# Altium project Arm.PrjPcb
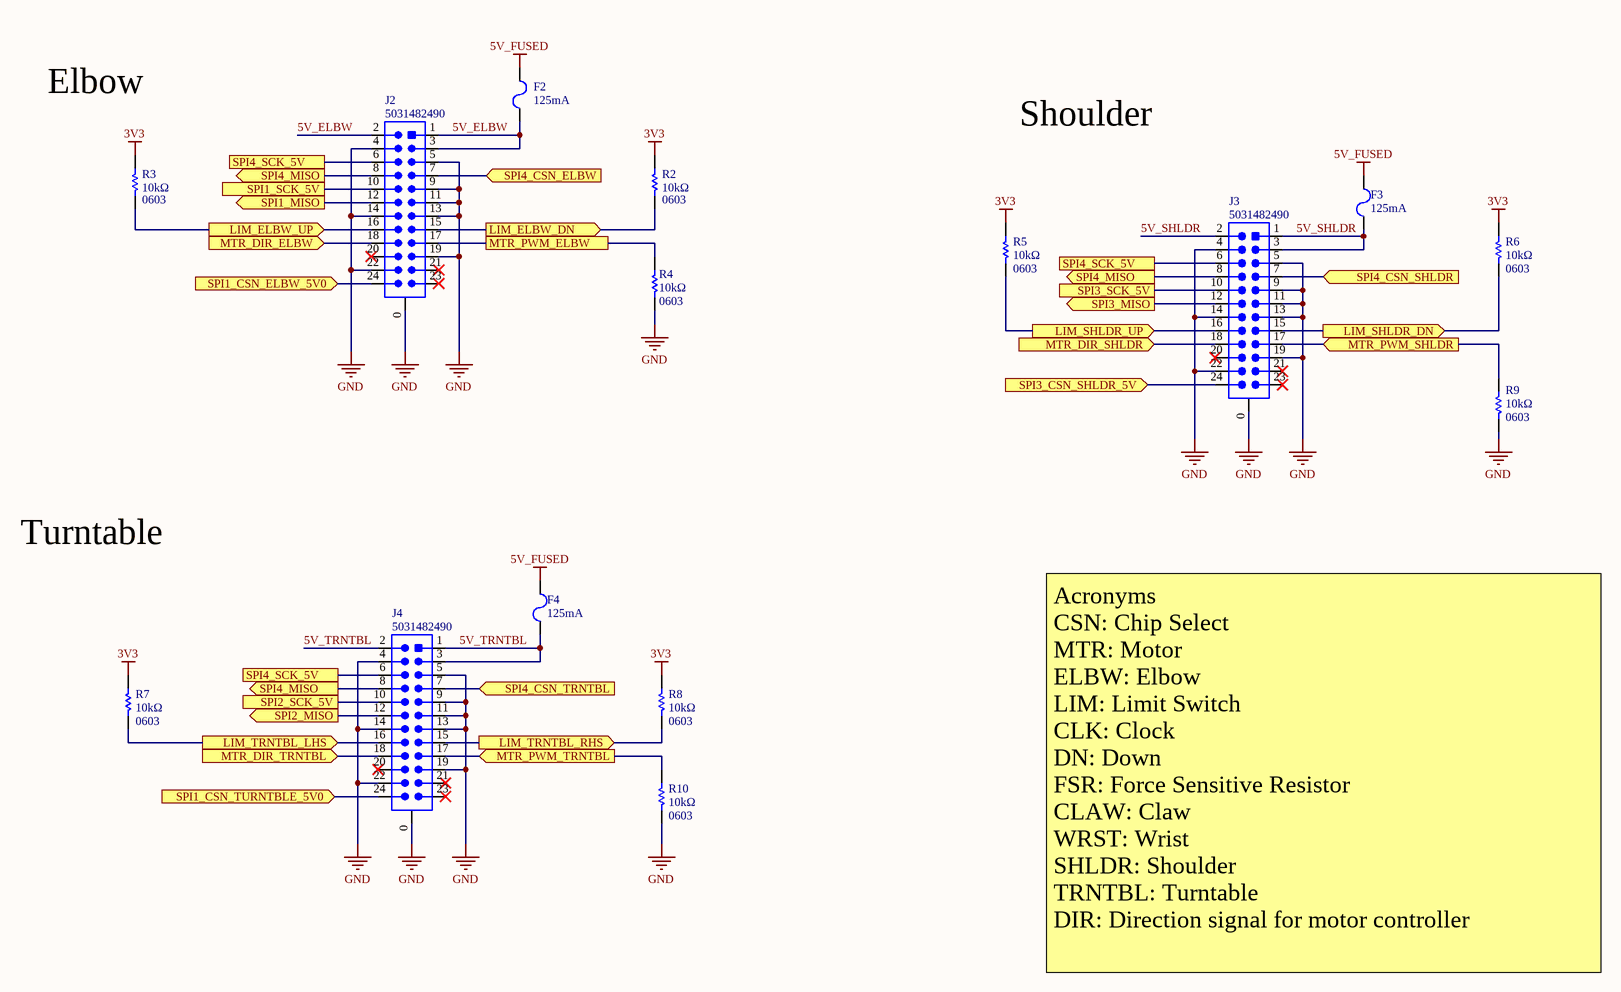
[diagram p0: SH2 - CONNECTORS_1.SchDoc]
CheckedBy: Lance Bantoto; Engineer: Kyle Hong; Revision: 2
5 sheets, 93 parts. Net scope: flat (ports and power ports of the same name join across sheets).
Board file: Arm.PcbDoc
Sheets:
  SH2 - CONNECTORS_1.SchDoc
  SH3 - CONNECTORS_2.SchDoc
  SH4 - LEVEL SHIFTERS.SchDoc
  SH5 - MICROCONTROLLER.SchDoc
  SH6 - CAN.SchDoc

## Sheet SH2 - CONNECTORS_1.SchDoc: Connectors 1
size B; CheckedBy: Lance Bantoto; DrawnBy: Kyle Hong; Engineer: Kyle Hong; Revision: 2; SheetNumber: 2; SheetTotal: 8

### Parts
F2  Current Rating: 125mA  [FUSE_1206]  (hidden comment: FUSE_125mA_1206)
F3  Current Rating: 125mA  [FUSE_1206]  (hidden comment: FUSE_125mA_1206)
F4  Current Rating: 125mA  [FUSE_1206]  (hidden comment: FUSE_125mA_1206)
J2  Manufacturer Part Number 1: 5031482490  [MOLEX-5031482490]  (hidden comment: CON_12x2M_SM_RA)
J3  Manufacturer Part Number 1: 5031482490  [MOLEX-5031482490]  (hidden comment: CON_12x2M_SM_RA)
J4  Manufacturer Part Number 1: 5031482490  [MOLEX-5031482490]  (hidden comment: CON_12x2M_SM_RA)
R2  value 10kΩ  Package/Footprint: 0603  [RESC0603]  (hidden comment: RES_10kΩ_0603_5%)
R3  value 10kΩ  Package/Footprint: 0603  [RESC0603]  (hidden comment: RES_10kΩ_0603_5%)
R4  value 10kΩ  Package/Footprint: 0603  [RESC0603]  (hidden comment: RES_10kΩ_0603_5%)
R5  value 10kΩ  Package/Footprint: 0603  [RESC0603]  (hidden comment: RES_10kΩ_0603_5%)
R6  value 10kΩ  Package/Footprint: 0603  [RESC0603]  (hidden comment: RES_10kΩ_0603_5%)
R7  value 10kΩ  Package/Footprint: 0603  [RESC0603]  (hidden comment: RES_10kΩ_0603_5%)
R8  value 10kΩ  Package/Footprint: 0603  [RESC0603]  (hidden comment: RES_10kΩ_0603_5%)
R9  value 10kΩ  Package/Footprint: 0603  [RESC0603]  (hidden comment: RES_10kΩ_0603_5%)
R10  value 10kΩ  Package/Footprint: 0603  [RESC0603]  (hidden comment: RES_10kΩ_0603_5%)

### Ports
LIM_ELBW_DN (out), LIM_ELBW_UP (out), LIM_SHLDR_DN (out), LIM_SHLDR_UP (out), LIM_TRNTBL_LHS (out), LIM_TRNTBL_RHS (out), MTR_DIR_ELBW (in), MTR_DIR_SHLDR (in), MTR_DIR_TRNTBL (in), MTR_PWM_ELBW, MTR_PWM_SHLDR (in), MTR_PWM_TRNTBL (in), SPI1_CSN_ELBW_5V0 (in), SPI1_CSN_TURNTBLE_5V0 (in), SPI1_MISO (out), SPI1_SCK_5V, SPI2_MISO (out), SPI2_SCK_5V, SPI3_CSN_SHLDR_5V (in), SPI3_MISO (out), SPI3_SCK_5V, SPI4_CSN_ELBW (in), SPI4_CSN_SHLDR (in), SPI4_CSN_TRNTBL (in), SPI4_MISO (out), SPI4_SCK_5V

### Nets
3V3: R2.2 R3.2 R5.2 R6.2 R7.2 R8.2
5V_FUSED: F2.2 F3.2 F4.2
GND: J2.0 J2.4 J2.5 J2.9 J2.11 J2.13 J2.14 J2.19 J2.22 J3.0 J3.4 J3.5 J3.9 J3.11 J3.13 J3.14 J3.19 J3.22 J4.0 J4.4 J4.5 J4.9 J4.11 J4.13 J4.14 J4.19 J4.22 R4.1 R9.1 R10.1
5V_ELBW: F2.1 J2.1 J2.2 J2.3
5V_SHLDR: F3.1 J3.1 J3.2 J3.3
5V_TRNTBL: F4.1 J4.1 J4.2 J4.3
NetJ2_6: J2.6 J3.6 J4.6 ; port SPI4_SCK_5V
NetJ2_7: J2.7 ; port SPI4_CSN_ELBW
NetJ2_8: J2.8 J3.8 J4.8 ; port SPI4_MISO
NetJ2_10: J2.10 ; port SPI1_SCK_5V
NetJ2_12: J2.12 ; port SPI1_MISO
NetJ2_15: J2.15 R2.1 ; port LIM_ELBW_DN
NetJ2_16: J2.16 R3.1 ; port LIM_ELBW_UP
NetJ2_17: J2.17 R4.2 ; port MTR_PWM_ELBW
NetJ2_18: J2.18 ; port MTR_DIR_ELBW
NetJ2_24: J2.24 ; port SPI1_CSN_ELBW_5V0
NetJ3_7: J3.7 ; port SPI4_CSN_SHLDR
NetJ3_10: J3.10 ; port SPI3_SCK_5V
NetJ3_12: J3.12 ; port SPI3_MISO
NetJ3_15: J3.15 R6.1 ; port LIM_SHLDR_DN
NetJ3_16: J3.16 R5.1 ; port LIM_SHLDR_UP
NetJ3_17: J3.17 R9.2 ; port MTR_PWM_SHLDR
NetJ3_18: J3.18 ; port MTR_DIR_SHLDR
NetJ3_24: J3.24 ; port SPI3_CSN_SHLDR_5V
NetJ4_7: J4.7 ; port SPI4_CSN_TRNTBL
NetJ4_10: J4.10 ; port SPI2_SCK_5V
NetJ4_12: J4.12 ; port SPI2_MISO
NetJ4_15: J4.15 R8.1 ; port LIM_TRNTBL_RHS
NetJ4_16: J4.16 R7.1 ; port LIM_TRNTBL_LHS
NetJ4_17: J4.17 R10.2 ; port MTR_PWM_TRNTBL
NetJ4_18: J4.18 ; port MTR_DIR_TRNTBL
NetJ4_24: J4.24 ; port SPI1_CSN_TURNTBLE_5V0

Not connected (* = marked no-connect by the designer): J2 20* 21* 23*; J3 20* 21* 23*; J4 20* 21* 23*

### Notes on the sheet
- Elbow
- Shoulder
- Turntable
- Acronyms
  CSN: Chip Select
  MTR: Motor
  ELBW: Elbow
  LIM: Limit Switch
  CLK: Clock
  DN: Down
  FSR: Force Sensitive Resistor
  CLAW: Claw
  WRST: Wrist
  SHLDR: Shoulder
  TRNTBL: Turntable
  DIR: Direction signal for motor controller
- Title:
- Project:
- Date:
- Rev:
- Reviewer:
- Engineer:
- Sheet:
- of

### Library data of the parts
F2-F4 = FUSE_125mA_1206: FUSE BOARD MNT 125MA 125VAC/VDC; Manufacturer 1: Littelfuse; Manufacturer Part Number 1: 0466.125NR; Voltage Rating (DC): 125V; Package/Footprint: 1206; Supplier 1: Digi-Key; Supplier Part Number 1: F1450CT-ND; Mounting Type: SMD
J2-J4 = CON_12x2M_SM_RA: CONN HEADER SMD RIGHT ANGLE 1.5MM PITCH; Manufacturer 1: Molex; Voltage Rating: 100V; Current Rating: 2A; Supplier 1: Digi-Key; Orientation: Right Angle; Pitch: 1.5mm; Supplier Part Number 1: WM20820CT-ND; Family: CLIK-Mate; Mounting Type: SMD; Package/Footprint: SMD
R2-R10 = RES_10kΩ_0603_5%: RES 10K OHM 5% 1/10W 0603; Manufacturer 1: Yageo; Manufacturer Part Number 1: RC0603JR-0710KL; Supplier Part Number 1: 311-10KGRCT-ND; Supplier 1: Digi-Key; Mounting Type: SMD

## Sheet SH3 - CONNECTORS_2.SchDoc: Connectors 2
size B; CheckedBy: Lance Bantoto; DrawnBy: Kyle Hong; Engineer: Kyle Hong; Revision: 2; SheetNumber: 3; SheetTotal: 8
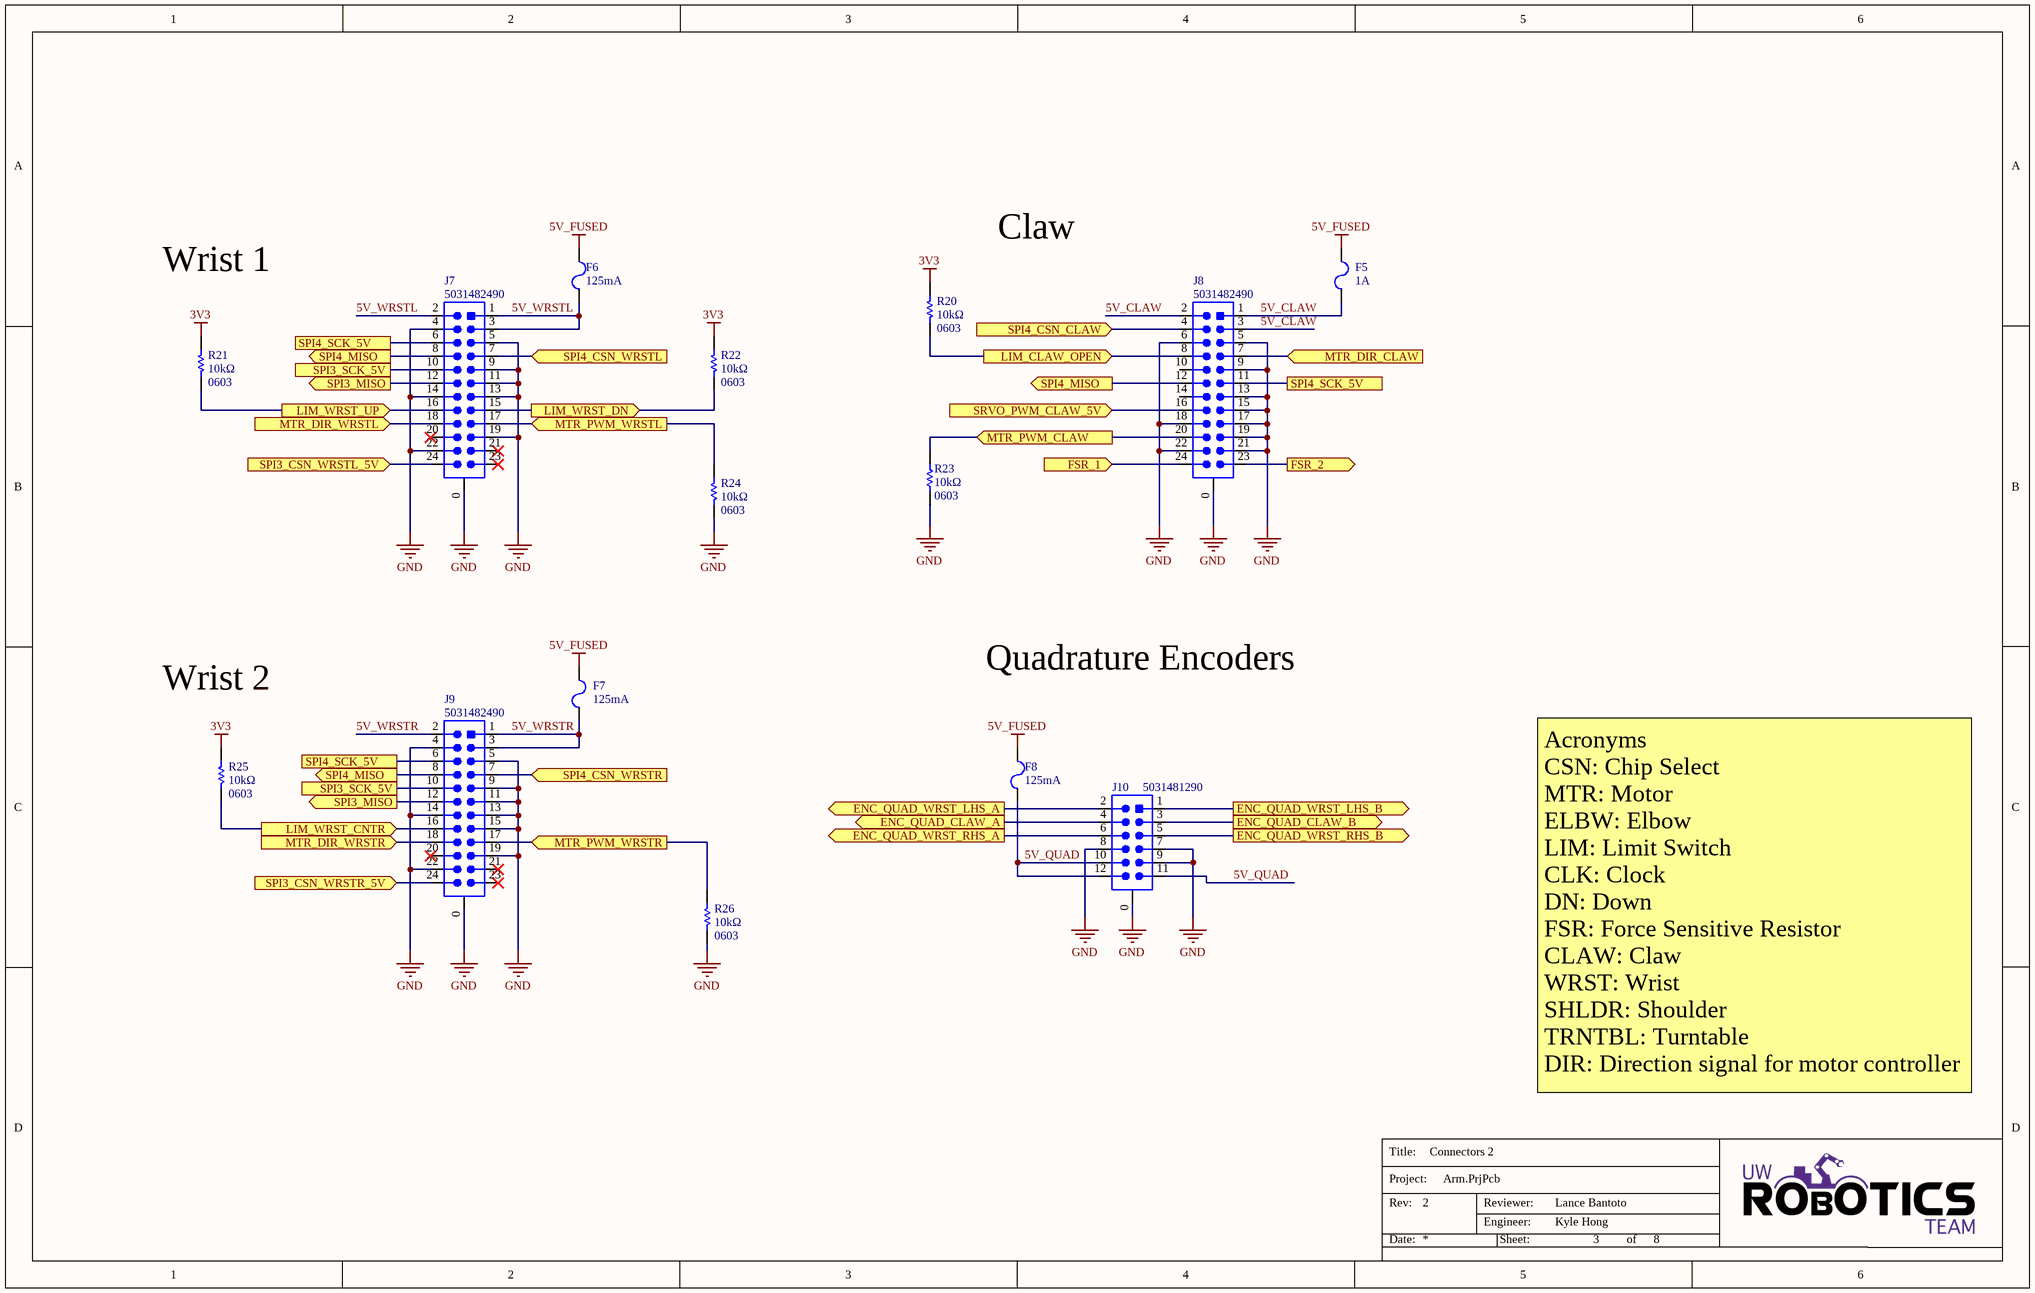
[diagram p1: SH3 - CONNECTORS_2.SchDoc]

### Parts
F5  Current Rating: 1A  [FUSE_1206]  (hidden comment: FUSE_1A_1206)
F6  Current Rating: 125mA  [FUSE_1206]  (hidden comment: FUSE_125mA_1206)
F7  Current Rating: 125mA  [FUSE_1206]  (hidden comment: FUSE_125mA_1206)
F8  Current Rating: 125mA  [FUSE_1206]  (hidden comment: FUSE_125mA_1206)
J7  Manufacturer Part Number 1: 5031482490  [MOLEX-5031482490]  (hidden comment: CON_12x2M_SM_RA)
J8  Manufacturer Part Number 1: 5031482490  [MOLEX-5031482490]  (hidden comment: CON_12x2M_SM_RA)
J9  Manufacturer Part Number 1: 5031482490  [MOLEX-5031482490]  (hidden comment: CON_12x2M_SM_RA)
J10  Manufacturer Part Number 1: 5031481290  [MOLEX-5031481290]  (hidden comment: CON_6x2M_SM_RA)
R20  value 10kΩ  Package/Footprint: 0603  [RESC0603]  (hidden comment: RES_10kΩ_0603_5%)
R21  value 10kΩ  Package/Footprint: 0603  [RESC0603]  (hidden comment: RES_10kΩ_0603_5%)
R22  value 10kΩ  Package/Footprint: 0603  [RESC0603]  (hidden comment: RES_10kΩ_0603_5%)
R23  value 10kΩ  Package/Footprint: 0603  [RESC0603]  (hidden comment: RES_10kΩ_0603_5%)
R24  value 10kΩ  Package/Footprint: 0603  [RESC0603]  (hidden comment: RES_10kΩ_0603_5%)
R25  value 10kΩ  Package/Footprint: 0603  [RESC0603]  (hidden comment: RES_10kΩ_0603_5%)
R26  value 10kΩ  Package/Footprint: 0603  [RESC0603]  (hidden comment: RES_10kΩ_0603_5%)

### Ports
ENC_QUAD_CLAW_A (out), ENC_QUAD_CLAW_B (out), ENC_QUAD_WRST_LHS_A (out), ENC_QUAD_WRST_LHS_B (out), ENC_QUAD_WRST_RHS_A (out), ENC_QUAD_WRST_RHS_B (out), FSR_1 (in), FSR_2 (out), LIM_CLAW_OPEN (out), LIM_WRST_CNTR (out), LIM_WRST_DN (out), LIM_WRST_UP (out), MTR_DIR_CLAW (in), MTR_DIR_WRSTL (in), MTR_DIR_WRSTR (in), MTR_PWM_CLAW (in), MTR_PWM_WRSTL (in), MTR_PWM_WRSTR (in), SPI3_CSN_WRSTL_5V (in), SPI3_CSN_WRSTR_5V (in), SPI3_MISO (out), SPI3_SCK_5V, SPI4_CSN_CLAW (in), SPI4_CSN_WRSTL (in), SPI4_CSN_WRSTR (in), SPI4_MISO (out), SPI4_SCK_5V, SRVO_PWM_CLAW_5V (in)

### Nets
3V3: R20.2 R21.2 R22.2 R25.2
5V_FUSED: F5.2 F6.2 F7.2 F8.2
GND: J7.0 J7.4 J7.5 J7.9 J7.11 J7.13 J7.14 J7.19 J7.22 J8.0 J8.5 J8.6 J8.9 J8.13 J8.15 J8.17 J8.18 J8.19 J8.21 J8.22 J9.0 J9.4 J9.5 J9.9 J9.11 J9.13 J9.14 J9.15 J9.19 J9.22 J10.0 J10.7 J10.8 J10.9 R23.1 R24.1 R26.1
5V_CLAW: F5.1 J8.1 J8.2 J8.3
5V_QUAD: F8.1 J10.10 J10.11 J10.12
5V_WRSTL: F6.1 J7.1 J7.2 J7.3
5V_WRSTR: F7.1 J9.1 J9.2 J9.3
NetJ2_6: J7.6 J8.11 J9.6 ; port SPI4_SCK_5V
NetJ2_8: J7.8 J8.12 J9.8 ; port SPI4_MISO
NetJ3_10: J7.10 J9.10 ; port SPI3_SCK_5V
NetJ3_12: J7.12 J9.12 ; port SPI3_MISO
NetJ7_7: J7.7 ; port SPI4_CSN_WRSTL
NetJ7_15: J7.15 R22.1 ; port LIM_WRST_DN
NetJ7_16: J7.16 R21.1 ; port LIM_WRST_UP
NetJ7_17: J7.17 R24.2 ; port MTR_PWM_WRSTL
NetJ7_18: J7.18 ; port MTR_DIR_WRSTL
NetJ7_24: J7.24 ; port SPI3_CSN_WRSTL_5V
NetJ8_4: J8.4 ; port SPI4_CSN_CLAW
NetJ8_7: J8.7 ; port MTR_DIR_CLAW
NetJ8_8: J8.8 R20.1 ; port LIM_CLAW_OPEN
NetJ8_16: J8.16 ; port SRVO_PWM_CLAW_5V
NetJ8_20: J8.20 R23.2 ; port MTR_PWM_CLAW
NetJ8_23: J8.23 ; port FSR_2
NetJ8_24: J8.24 ; port FSR_1
NetJ9_7: J9.7 ; port SPI4_CSN_WRSTR
NetJ9_16: J9.16 R25.1 ; port LIM_WRST_CNTR
NetJ9_17: J9.17 R26.2 ; port MTR_PWM_WRSTR
NetJ9_18: J9.18 ; port MTR_DIR_WRSTR
NetJ9_24: J9.24 ; port SPI3_CSN_WRSTR_5V
NetJ10_1: J10.1 ; port ENC_QUAD_WRST_LHS_B
NetJ10_2: J10.2 ; port ENC_QUAD_WRST_LHS_A
NetJ10_3: J10.3 ; port ENC_QUAD_CLAW_B
NetJ10_4: J10.4 ; port ENC_QUAD_CLAW_A
NetJ10_5: J10.5 ; port ENC_QUAD_WRST_RHS_B
NetJ10_6: J10.6 ; port ENC_QUAD_WRST_RHS_A

Not connected (* = marked no-connect by the designer): J7 20* 21* 23*; J8 10 14; J9 20* 21* 23*

### Notes on the sheet
- Wrist 1
- Claw
- Wrist 2
- Quadrature Encoders
- Acronyms
  CSN: Chip Select
  MTR: Motor
  ELBW: Elbow
  LIM: Limit Switch
  CLK: Clock
  DN: Down
  FSR: Force Sensitive Resistor
  CLAW: Claw
  WRST: Wrist
  SHLDR: Shoulder
  TRNTBL: Turntable
  DIR: Direction signal for motor controller
- Title:
- Project:
- Date:
- Rev:
- Reviewer:
- Engineer:
- Sheet:
- of

### Library data of the parts
F5 = FUSE_1A_1206: FUSE BOARD MOUNT 1A 125VAC 63VDC; Manufacturer 1: Bel Fuse Inc.; Manufacturer Part Number 1: C1Q 1; Package/Footprint: 1206; Supplier 1: Digi-Key; Supplier Part Number 1: 507-1077-1-ND; Mounting Type: SMD; LCSC Part #: *
F6-F8 = FUSE_125mA_1206: as F2 on sheet SH2 - CONNECTORS_1; Supplier 1: Digi-Key; Supplier Part Number 1: F1450CT-ND; Mounting Type: SMD
J7-J9 = CON_12x2M_SM_RA: as J2 on sheet SH2 - CONNECTORS_1; Supplier 1: Digi-Key; Orientation: Right Angle; Pitch: 1.5mm; Supplier Part Number 1: WM20820CT-ND; Family: CLIK-Mate; Mounting Type: SMD; Package/Footprint: SMD
J10 = CON_6x2M_SM_RA: CONN HEADER SMD RIGHT ANGLE 1.5MM PITCH; Manufacturer 1: Molex; Voltage Rating: 100V; Current Rating: 1A; Supplier 1: Digi-Key; Orientation: Right Angle; Pitch: 1.5mm; Supplier Part Number 1: WM14476CT-ND; Mounting Type: SMD; Package/Footprint: SMD
R20-R26 = RES_10kΩ_0603_5%: as R2 on sheet SH2 - CONNECTORS_1; Supplier Part Number 1: 311-10KGRCT-ND; Supplier 1: Digi-Key; Mounting Type: SMD

## Sheet SH4 - LEVEL SHIFTERS.SchDoc: Level Shifters
size B; CheckedBy: Lance Bantoto; DrawnBy: Kyle Hong; Engineer: Kyle Hong; Revision: 2; SheetNumber: 4; SheetTotal: 8
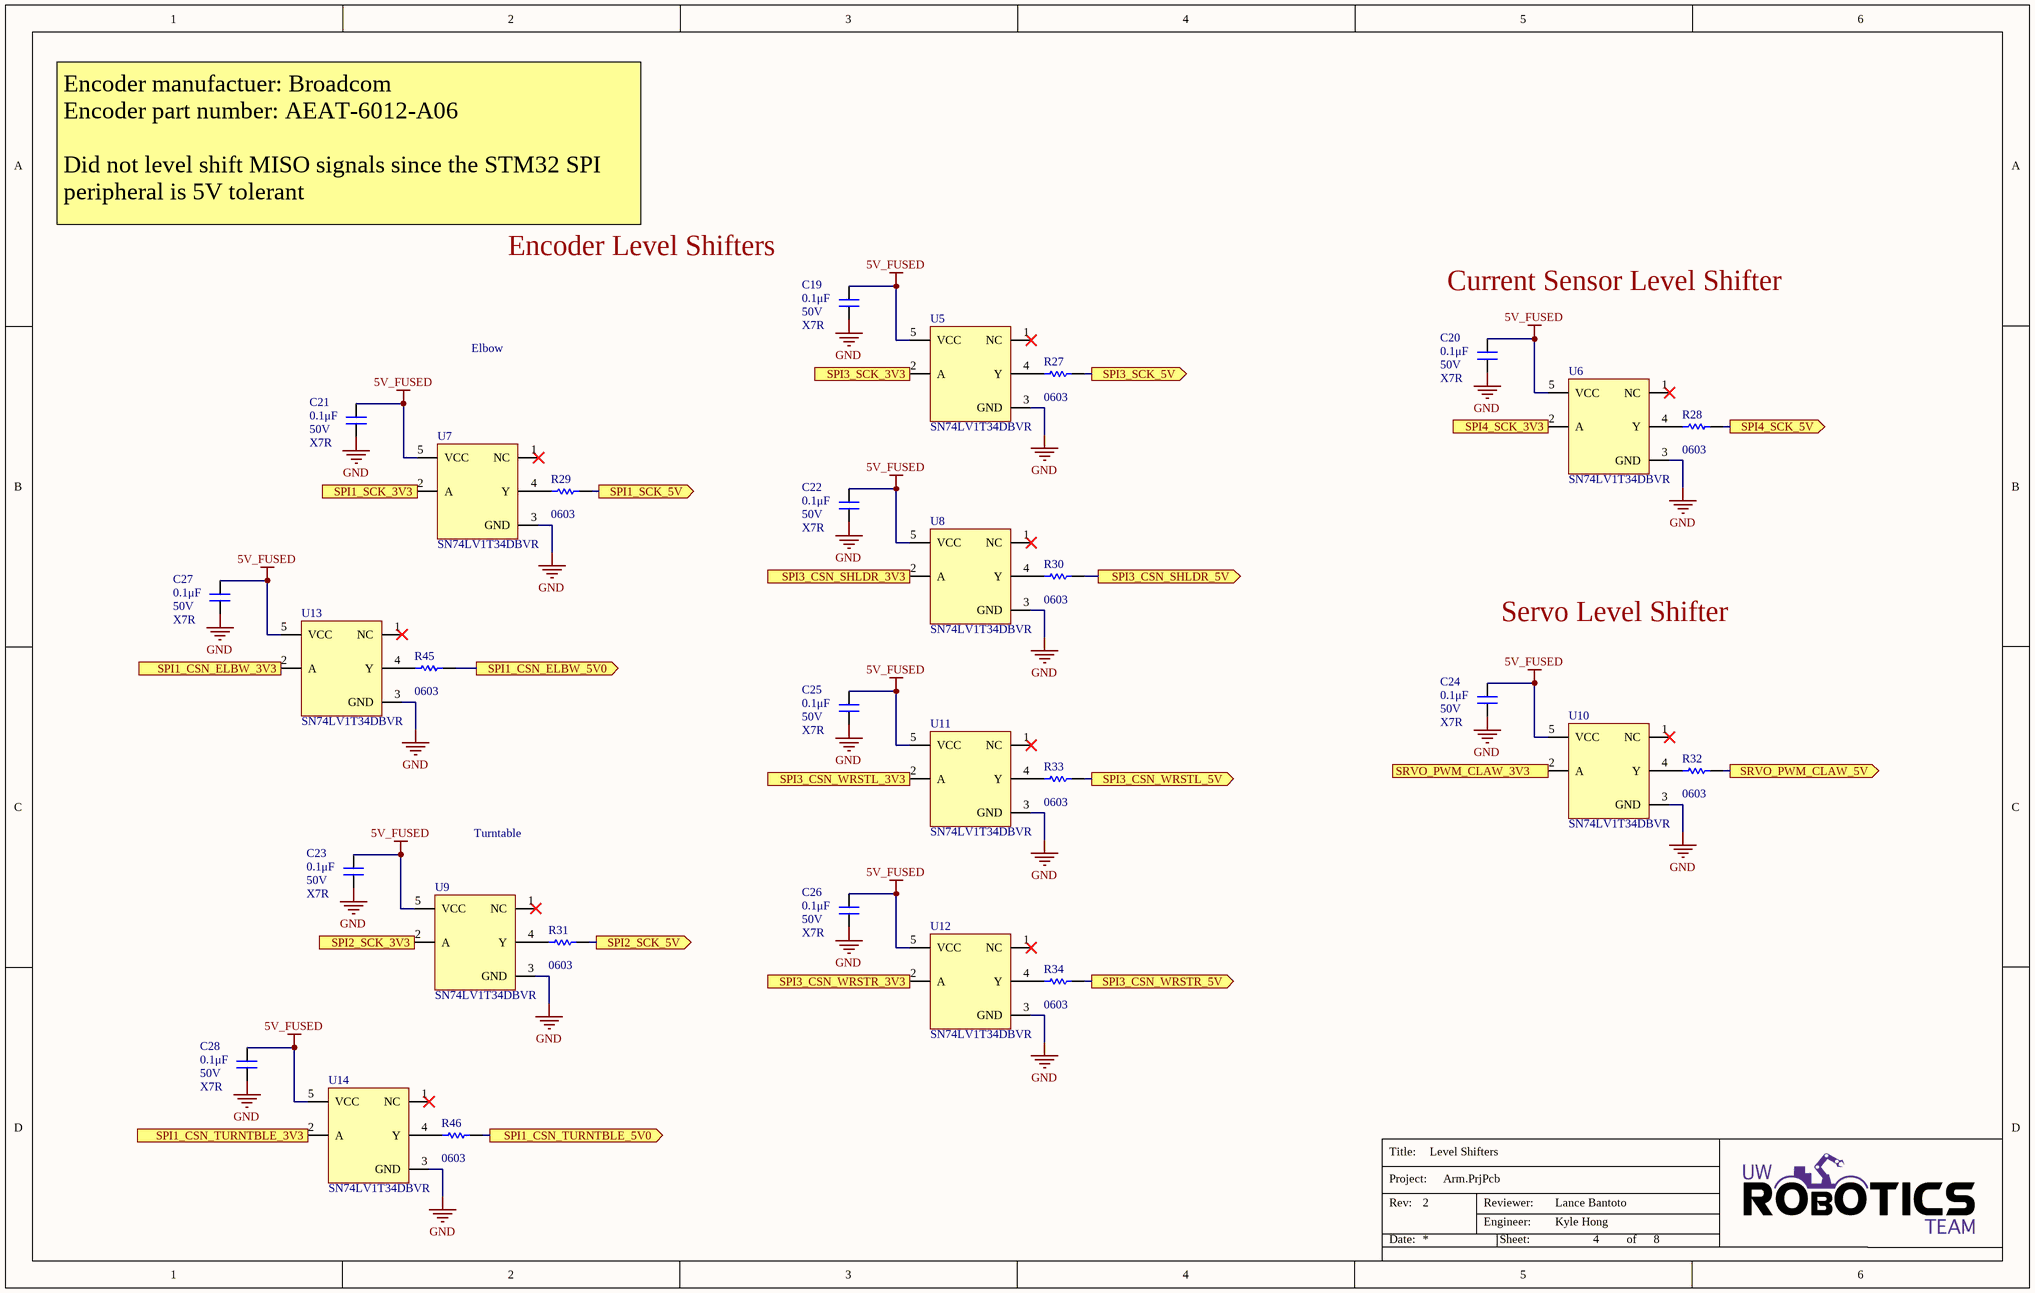
[diagram p2: SH4 - LEVEL SHIFTERS.SchDoc]

### Parts
C19  value 0.1μF  Dielectric: X7R  Voltage Rating: 50V  [CAP0603]  (hidden comment: CAP_0.1uF_50V_0603)
C20  value 0.1μF  Dielectric: X7R  Voltage Rating: 50V  [CAP0603]  (hidden comment: CAP_0.1uF_50V_0603)
C21  value 0.1μF  Dielectric: X7R  Voltage Rating: 50V  [CAP0603]  (hidden comment: CAP_0.1uF_50V_0603)
C22  value 0.1μF  Dielectric: X7R  Voltage Rating: 50V  [CAP0603]  (hidden comment: CAP_0.1uF_50V_0603)
C23  value 0.1μF  Dielectric: X7R  Voltage Rating: 50V  [CAP0603]  (hidden comment: CAP_0.1uF_50V_0603)
C24  value 0.1μF  Dielectric: X7R  Voltage Rating: 50V  [CAP0603]  (hidden comment: CAP_0.1uF_50V_0603)
C25  value 0.1μF  Dielectric: X7R  Voltage Rating: 50V  [CAP0603]  (hidden comment: CAP_0.1uF_50V_0603)
C26  value 0.1μF  Dielectric: X7R  Voltage Rating: 50V  [CAP0603]  (hidden comment: CAP_0.1uF_50V_0603)
C27  value 0.1μF  Dielectric: X7R  Voltage Rating: 50V  [CAP0603]  (hidden comment: CAP_0.1uF_50V_0603)
C28  value 0.1μF  Dielectric: X7R  Voltage Rating: 50V  [CAP0603]  (hidden comment: CAP_0.1uF_50V_0603)
R27  Package/Footprint: 0603  [RESC0603]  (hidden comment: RES_33Ω_0603_1%)
R28  Package/Footprint: 0603  [RESC0603]  (hidden comment: RES_33Ω_0603_1%)
R29  Package/Footprint: 0603  [RESC0603]  (hidden comment: RES_33Ω_0603_1%)
R30  Package/Footprint: 0603  [RESC0603]  (hidden comment: RES_33Ω_0603_1%)
R31  Package/Footprint: 0603  [RESC0603]  (hidden comment: RES_33Ω_0603_1%)
R32  Package/Footprint: 0603  [RESC0603]  (hidden comment: RES_33Ω_0603_1%)
R33  Package/Footprint: 0603  [RESC0603]  (hidden comment: RES_33Ω_0603_1%)
R34  Package/Footprint: 0603  [RESC0603]  (hidden comment: RES_33Ω_0603_1%)
R45  Package/Footprint: 0603  [RESC0603]  (hidden comment: RES_33Ω_0603_1%)
R46  Package/Footprint: 0603  [RESC0603]  (hidden comment: RES_33Ω_0603_1%)
U5  SN74LV1T34  [SN74LV1T34DBVR]  (value not drawn)
U6  SN74LV1T34  [SN74LV1T34DBVR]  (value not drawn)
U7  SN74LV1T34  [SN74LV1T34DBVR]  (value not drawn)
U8  SN74LV1T34  [SN74LV1T34DBVR]  (value not drawn)
U9  SN74LV1T34  [SN74LV1T34DBVR]  (value not drawn)
U10  SN74LV1T34  [SN74LV1T34DBVR]  (value not drawn)
U11  SN74LV1T34  [SN74LV1T34DBVR]  (value not drawn)
U12  SN74LV1T34  [SN74LV1T34DBVR]  (value not drawn)
U13  SN74LV1T34  [SN74LV1T34DBVR]  (value not drawn)
U14  SN74LV1T34  [SN74LV1T34DBVR]  (value not drawn)

### Ports
SPI1_CSN_ELBW_3V3 (in), SPI1_CSN_ELBW_5V0 (out), SPI1_CSN_TURNTBLE_3V3 (in), SPI1_CSN_TURNTBLE_5V0 (out), SPI1_SCK_3V3 (in), SPI1_SCK_5V (out), SPI2_SCK_3V3 (in), SPI2_SCK_5V (out), SPI3_CSN_SHLDR_3V3 (in), SPI3_CSN_SHLDR_5V (out), SPI3_CSN_WRSTL_3V3 (in), SPI3_CSN_WRSTL_5V (out), SPI3_CSN_WRSTR_3V3 (in), SPI3_CSN_WRSTR_5V (out), SPI3_SCK_3V3 (in), SPI3_SCK_5V (out), SPI4_SCK_3V3 (in), SPI4_SCK_5V (out), SRVO_PWM_CLAW_3V3 (in), SRVO_PWM_CLAW_5V (out)

### Nets
5V_FUSED: C19.2 C20.2 C21.2 C22.2 C23.2 C24.2 C25.2 C26.2 C27.2 C28.2 U5.5(VCC) U6.5(VCC) U7.5(VCC) U8.5(VCC) U9.5(VCC) U10.5(VCC) U11.5(VCC) U12.5(VCC) U13.5(VCC) U14.5(VCC)
GND: C19.1 C20.1 C21.1 C22.1 C23.1 C24.1 C25.1 C26.1 C27.1 C28.1 U5.3(GND) U6.3(GND) U7.3(GND) U8.3(GND) U9.3(GND) U10.3(GND) U11.3(GND) U12.3(GND) U13.3(GND) U14.3(GND)
NetJ2_6: R28.2 ; port SPI4_SCK_5V
NetJ2_10: R29.2 ; port SPI1_SCK_5V
NetJ2_24: R45.2 ; port SPI1_CSN_ELBW_5V0
NetJ3_10: R27.2 ; port SPI3_SCK_5V
NetJ3_24: R30.2 ; port SPI3_CSN_SHLDR_5V
NetJ4_10: R31.2 ; port SPI2_SCK_5V
NetJ4_24: R46.2 ; port SPI1_CSN_TURNTBLE_5V0
NetJ7_24: R33.2 ; port SPI3_CSN_WRSTL_5V
NetJ8_16: R32.2 ; port SRVO_PWM_CLAW_5V
NetJ9_24: R34.2 ; port SPI3_CSN_WRSTR_5V
NetR27_1: R27.1 U5.4(Y)
NetR28_1: R28.1 U6.4(Y)
NetR29_1: R29.1 U7.4(Y)
NetR30_1: R30.1 U8.4(Y)
NetR31_1: R31.1 U9.4(Y)
NetR32_1: R32.1 U10.4(Y)
NetR33_1: R33.1 U11.4(Y)
NetR34_1: R34.1 U12.4(Y)
NetR45_1: R45.1 U13.4(Y)
NetR46_1: R46.1 U14.4(Y)
NetU2_32: U10.2(A) ; port SRVO_PWM_CLAW_3V3
NetU2_34: U12.2(A) ; port SPI3_CSN_WRSTR_3V3
NetU2_43: U6.2(A) ; port SPI4_SCK_3V3
NetU2_47: U9.2(A) ; port SPI2_SCK_3V3
NetU2_55: U14.2(A) ; port SPI1_CSN_TURNTBLE_3V3
NetU2_56: U13.2(A) ; port SPI1_CSN_ELBW_3V3
NetU2_78: U5.2(A) ; port SPI3_SCK_3V3
NetU2_81: U11.2(A) ; port SPI3_CSN_WRSTL_3V3
NetU2_83: U8.2(A) ; port SPI3_CSN_SHLDR_3V3
NetU2_89: U7.2(A) ; port SPI1_SCK_3V3

Not connected (* = marked no-connect by the designer): U5 1(NC)*; U6 1(NC)*; U7 1(NC)*; U8 1(NC)*; U9 1(NC)*; U10 1(NC)*; U11 1(NC)*; U12 1(NC)*; U13 1(NC)*; U14 1(NC)*

### Notes on the sheet
- Encoder manufactuer: Broadcom
  Encoder part number: AEAT-6012-A06
  Did not level shift MISO signals since the STM32 SPI peripheral is 5V tolerant
- (near C19) Encoder Level Shifters
- Current Sensor Level Shifter
- Elbow
- Servo Level Shifter
- Turntable
- Title:
- Project:
- Date:
- Rev:
- Reviewer:
- Engineer:
- Sheet:
- of

### Library data of the parts
C19-C28 = CAP_0.1uF_50V_0603: CAP CER 0.1UF 50V X7R 0603; Manufacturer Part Number 1: CC0603KRX7R9BB104; Manufacturer 1: Yageo; Package/Footprint: 0603; Supplier Part Number 1: 311-1344-1-ND; Supplier 1: Digi-Key; Mounting Type: SMD
R27-R34 R45 R46 = RES_33Ω_0603_1%: RES 33 OHM 1% 1/10W 0603; Manufacturer 1: Vishay; Manufacturer Part Number 1: CRCW060333R0FKEA; Supplier 1: Digi-Key; Supplier Part Number 1: 541-33.0HCT-ND; Mounting Type: SMD
U5-U14 = SN74LV1T34: IC BUF NON-INVERT 5.5V SOT23-5; Manufacturer 1: Texas Instruments; Package/Footprint: SOT-23-5; Supplier 1: Digi-Key; Supplier Part Number 1: 296-37176-1-ND; Manufacturer Part Number 1: SN74LV1T34DBVR; Mounting Type: SMD; LCSC Part #: C100024

## Sheet SH5 - MICROCONTROLLER.SchDoc: Microcontroller
size B; CheckedBy: Lance Bantoto; DrawnBy: Kyle Hong; Engineer: Kyle Hong; Organization: UW Robotics; Address1: 200 University Avenue; Address2: Waterloo; Address3: Ontario; Address4: Canada N2L 3G6; Revision: 2; SheetNumber: 6; SheetTotal: 8
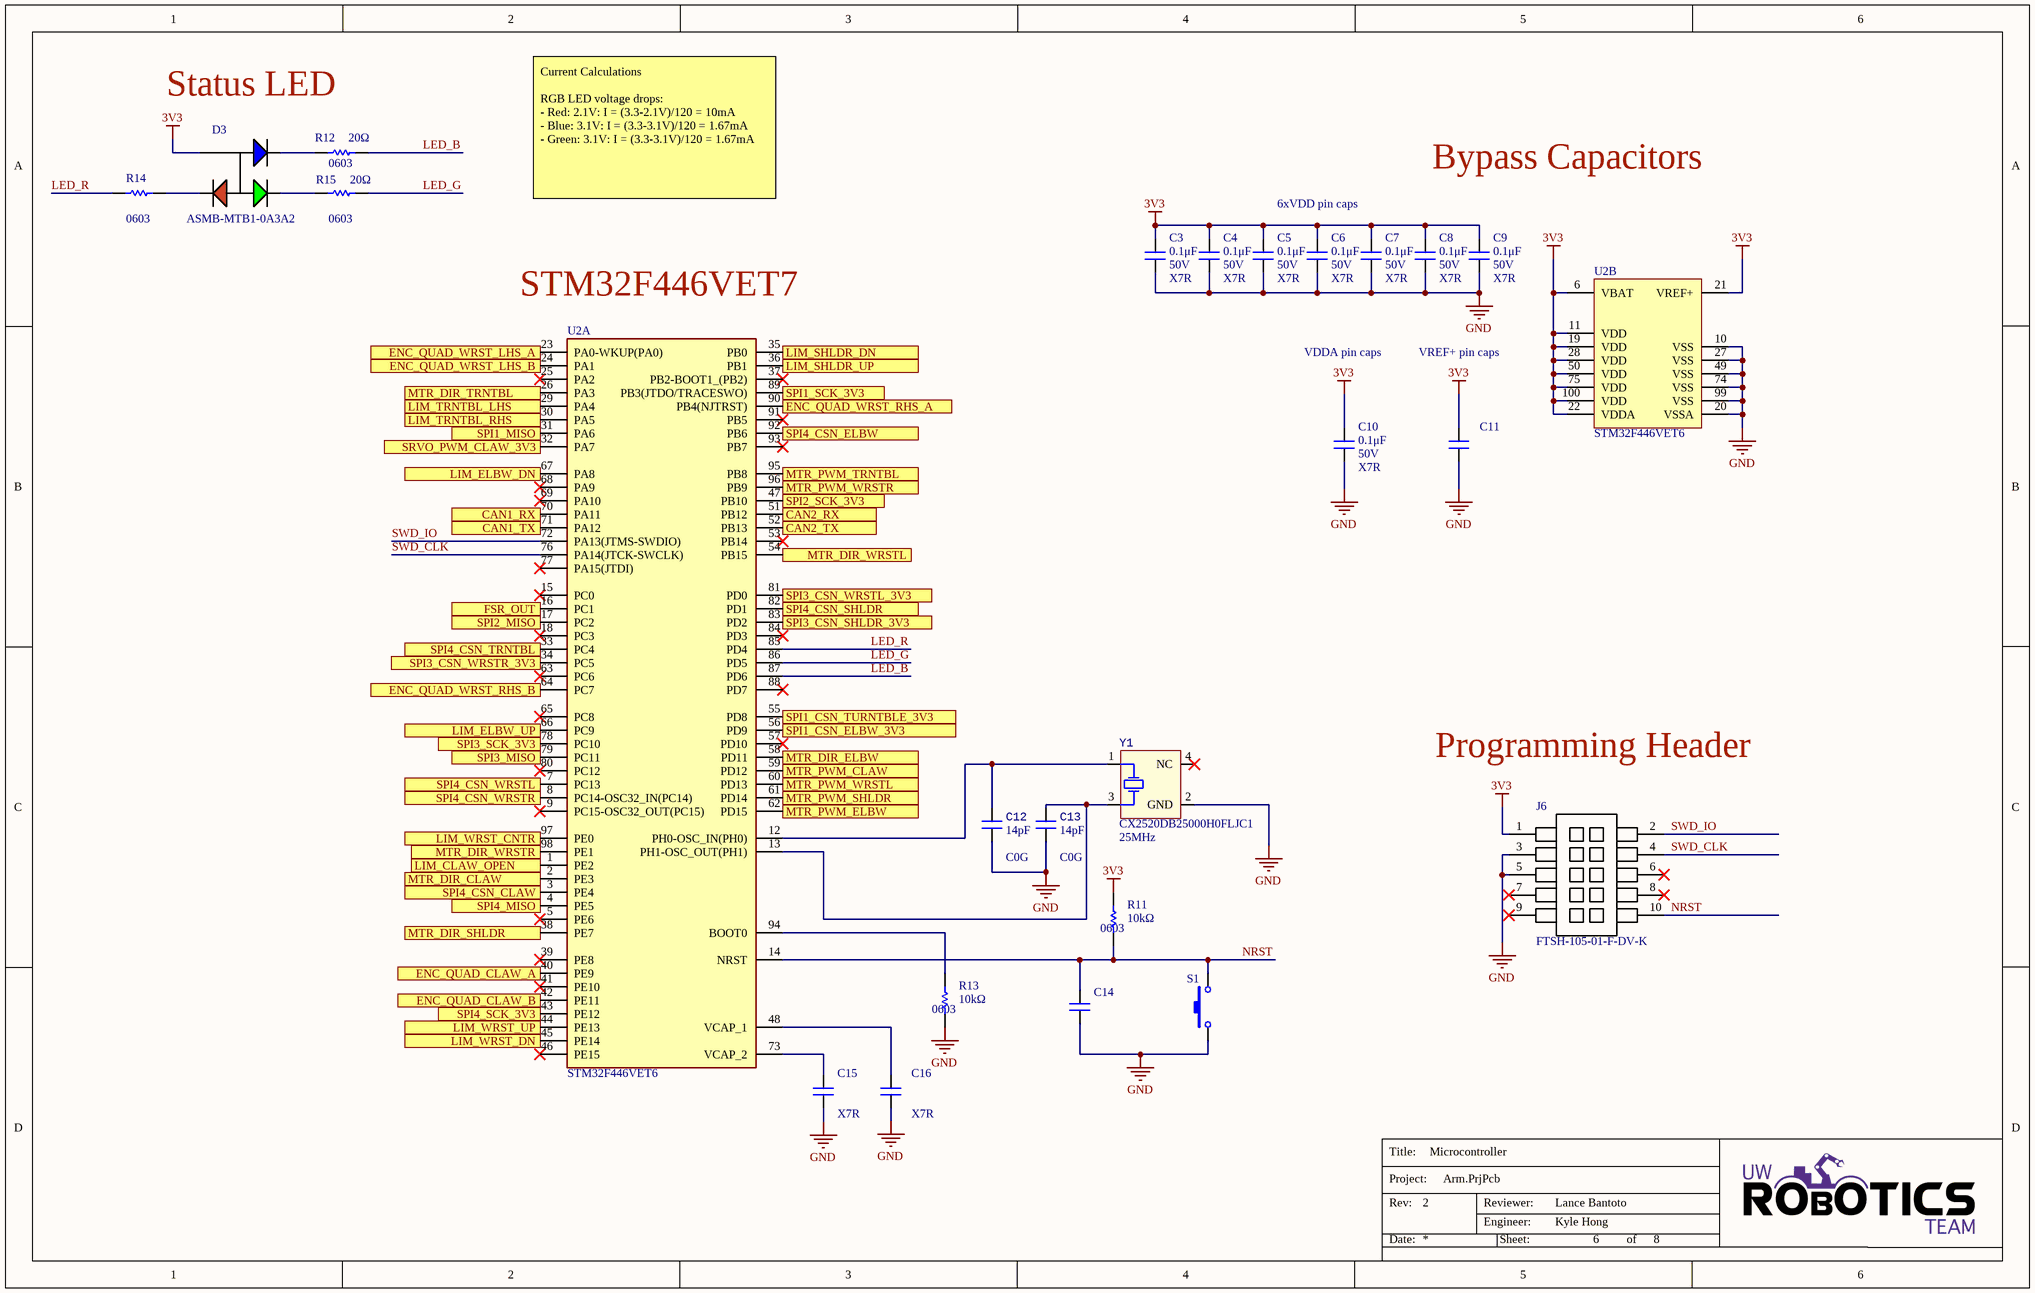
[diagram p3: SH5 - MICROCONTROLLER.SchDoc]

### Parts
C3  value 0.1μF  Voltage Rating: 50V  Dielectric: X7R  [CAP0603]  (hidden comment: CAP_0.1uF_50V_0603)
C4  value 0.1μF  Voltage Rating: 50V  Dielectric: X7R  [CAP0603]  (hidden comment: CAP_0.1uF_50V_0603)
C5  value 0.1μF  Voltage Rating: 50V  Dielectric: X7R  [CAP0603]  (hidden comment: CAP_0.1uF_50V_0603)
C6  value 0.1μF  Voltage Rating: 50V  Dielectric: X7R  [CAP0603]  (hidden comment: CAP_0.1uF_50V_0603)
C7  value 0.1μF  Voltage Rating: 50V  Dielectric: X7R  [CAP0603]  (hidden comment: CAP_0.1uF_50V_0603)
C8  value 0.1μF  Voltage Rating: 50V  Dielectric: X7R  [CAP0603]  (hidden comment: CAP_0.1uF_50V_0603)
C9  value 0.1μF  Voltage Rating: 50V  Dielectric: X7R  [CAP0603]  (hidden comment: CAP_0.1uF_50V_0603)
C10  value 0.1μF  Voltage Rating: 50V  Dielectric: X7R  [CAP0603]  (hidden comment: CAP_0.1uF_50V_0603)
C11  CAP_1uF_25V_0603  [CAP0603]  (value not drawn)
C12  value 14pF  Dielectric: C0G  [CAP0603]  (hidden comment: CAP_14pF_50V_0603)
C13  value 14pF  Dielectric: C0G  [CAP0603]  (hidden comment: CAP_14pF_50V_0603)
C14  CAP_1uF_25V_0603  [CAP0603]  (value not drawn)
C15  Dielectric: X7R  [CAP1206]  (hidden comment: CAP_4.7uF_50V_1206)
C16  Dielectric: X7R  [CAP1206]  (hidden comment: CAP_4.7uF_50V_1206)
D3  Manufacturer Part Number 1: ASMB-MTB1-0A3A2  [LED_RGB]  (hidden comment: LED_RGB)
J6  Manufacturer Part Number 1: FTSH-105-01-F-DV-K  [FTSH-105-01-F-DV-K-P-TR]  (hidden comment: CON_PROGRAMMING)
R11  value 10kΩ  Package/Footprint: 0603  [RESC0603]  (hidden comment: RES_10kΩ_0603_5%)
R12  value 20Ω  Package/Footprint: 0603  [RESC0603]  (hidden comment: RES_20Ω_0603_5%)
R13  value 10kΩ  Package/Footprint: 0603  [RESC0603]  (hidden comment: RES_10kΩ_0603_5%)
R14  Package/Footprint: 0603  [RESC0603]  (hidden comment: RES_120Ω_0603_5%_HP)
R15  value 20Ω  Package/Footprint: 0603  [RESC0603]  (hidden comment: RES_20Ω_0603_5%)
S1  SW_TACTILE  [B3U-1000P]  (value not drawn)
U2  STM32F446VET6  [STM32F446VET6]  (parts A,B of 2)
Y1  Manufacturer Part Number 1: CX2520DB25000H0FLJC1  Frequency: 25MHz  [SOIC254P1016X440-4N]  (hidden comment: CRYSTAL_25MHZ)

### Ports
CAN1_RX (out), CAN1_TX (in), CAN2_RX (out), CAN2_TX (in), ENC_QUAD_CLAW_A (in), ENC_QUAD_CLAW_B (in), ENC_QUAD_WRST_LHS_A (in), ENC_QUAD_WRST_LHS_B (in), ENC_QUAD_WRST_RHS_A (in), ENC_QUAD_WRST_RHS_B (in), FSR_OUT (in), LIM_CLAW_OPEN (in), LIM_ELBW_DN (in), LIM_ELBW_UP (in), LIM_SHLDR_DN (in), LIM_SHLDR_UP (in), LIM_TRNTBL_LHS (in), LIM_TRNTBL_RHS (in), LIM_WRST_CNTR (in), LIM_WRST_DN (in), LIM_WRST_UP (in), MTR_DIR_CLAW (out), MTR_DIR_ELBW (out), MTR_DIR_SHLDR (out), MTR_DIR_TRNTBL (out), MTR_DIR_WRSTL (out), MTR_DIR_WRSTR (out), MTR_PWM_CLAW (out), MTR_PWM_ELBW (out), MTR_PWM_SHLDR (out), MTR_PWM_TRNTBL (out), MTR_PWM_WRSTL (out), MTR_PWM_WRSTR (out), SPI1_CSN_ELBW_3V3 (out), SPI1_CSN_TURNTBLE_3V3 (out), SPI1_MISO (in), SPI1_SCK_3V3 (out), SPI2_MISO (in), SPI2_SCK_3V3, SPI3_CSN_SHLDR_3V3 (out), SPI3_CSN_WRSTL_3V3 (out), SPI3_CSN_WRSTR_3V3 (out), SPI3_MISO (in), SPI3_SCK_3V3 (out), SPI4_CSN_CLAW (out), SPI4_CSN_ELBW (out), SPI4_CSN_SHLDR (out), SPI4_CSN_TRNTBL (out), SPI4_CSN_WRSTL (out), SPI4_CSN_WRSTR (out), SPI4_MISO (in), SPI4_SCK_3V3 (out), SRVO_PWM_CLAW_3V3 (out)

### Nets
3V3: C3.1 C4.1 C5.1 C6.1 C7.1 C8.1 C9.1 C10.2 C11.2 D3.4(COMMON_ANODE) J6.1 R11.1 U2.6(VBAT) U2.11(VDD) U2.19(VDD) U2.21(VREF+) U2.22(VDDA) U2.28(VDD) U2.50(VDD) U2.75(VDD) U2.100(VDD)
GND: C3.2 C4.2 C5.2 C6.2 C7.2 C8.2 C9.2 C10.1 C11.1 C12.1 C13.1 C14.1 C15.1 C16.1 J6.3 J6.5 R13.2 S1.1 U2.10(VSS) U2.20(VSSA) U2.27(VSS) U2.49(VSS) U2.74(VSS) U2.99(VSS) Y1.2(GND)
LED_B: R12.2 U2.87(PD6)
LED_G: R15.2 U2.86(PD5)
LED_R: R14.1 U2.85(PD4)
NRST: C14.2 J6.10 R11.2 S1.2 U2.14(NRST)
SWD_CLK: J6.4 U2.76(PA14(JTCK-SWCLK))
SWD_IO: J6.2 U2.72(PA13(JTMS-SWDIO))
NetC12_2: C12.2 U2.12(PH0-OSC_IN(PH0)) Y1.1(HOT)
NetC13_2: C13.2 U2.13(PH1-OSC_OUT(PH1)) Y1.3(HOT)
NetC15_2: C15.2 U2.73(VCAP_2)
NetC16_2: C16.2 U2.48(VCAP_1)
NetD3_1: D3.1(CATHODE_(RED)) R14.2
NetD3_2: D3.2(CATHODE_(GREEN)) R15.1
NetD3_3: D3.3(CATHODE_(BLUE)) R12.1
NetJ2_7: U2.92(PB6) ; port SPI4_CSN_ELBW
NetJ2_8: U2.4(PE5) ; port SPI4_MISO
NetJ2_12: U2.31(PA6) ; port SPI1_MISO
NetJ2_15: U2.67(PA8) ; port LIM_ELBW_DN
NetJ2_16: U2.66(PC9) ; port LIM_ELBW_UP
NetJ2_17: U2.62(PD15) ; port MTR_PWM_ELBW
NetJ2_18: U2.58(PD11) ; port MTR_DIR_ELBW
NetJ3_7: U2.82(PD1) ; port SPI4_CSN_SHLDR
NetJ3_12: U2.79(PC11) ; port SPI3_MISO
NetJ3_15: U2.35(PB0) ; port LIM_SHLDR_DN
NetJ3_16: U2.36(PB1) ; port LIM_SHLDR_UP
NetJ3_17: U2.61(PD14) ; port MTR_PWM_SHLDR
NetJ3_18: U2.38(PE7) ; port MTR_DIR_SHLDR
NetJ4_7: U2.33(PC4) ; port SPI4_CSN_TRNTBL
NetJ4_12: U2.17(PC2) ; port SPI2_MISO
NetJ4_15: U2.30(PA5) ; port LIM_TRNTBL_RHS
NetJ4_16: U2.29(PA4) ; port LIM_TRNTBL_LHS
NetJ4_17: U2.95(PB8) ; port MTR_PWM_TRNTBL
NetJ4_18: U2.26(PA3) ; port MTR_DIR_TRNTBL
NetJ7_7: U2.7(PC13) ; port SPI4_CSN_WRSTL
NetJ7_15: U2.45(PE14) ; port LIM_WRST_DN
NetJ7_16: U2.44(PE13) ; port LIM_WRST_UP
NetJ7_17: U2.60(PD13) ; port MTR_PWM_WRSTL
NetJ7_18: U2.54(PB15) ; port MTR_DIR_WRSTL
NetJ8_4: U2.3(PE4) ; port SPI4_CSN_CLAW
NetJ8_7: U2.2(PE3) ; port MTR_DIR_CLAW
NetJ8_8: U2.1(PE2) ; port LIM_CLAW_OPEN
NetJ8_20: U2.59(PD12) ; port MTR_PWM_CLAW
NetJ9_7: U2.8(PC14-OSC32_IN(PC14)) ; port SPI4_CSN_WRSTR
NetJ9_16: U2.97(PE0) ; port LIM_WRST_CNTR
NetJ9_17: U2.96(PB9) ; port MTR_PWM_WRSTR
NetJ9_18: U2.98(PE1) ; port MTR_DIR_WRSTR
NetJ10_1: U2.24(PA1) ; port ENC_QUAD_WRST_LHS_B
NetJ10_2: U2.23(PA0-WKUP(PA0)) ; port ENC_QUAD_WRST_LHS_A
NetJ10_3: U2.42(PE11) ; port ENC_QUAD_CLAW_B
NetJ10_4: U2.40(PE9) ; port ENC_QUAD_CLAW_A
NetJ10_5: U2.64(PC7) ; port ENC_QUAD_WRST_RHS_B
NetJ10_6: U2.90(PB4(NJTRST)) ; port ENC_QUAD_WRST_RHS_A
NetR13_1: R13.1 U2.94(BOOT0)
NetU2_16: U2.16(PC1) ; port FSR_OUT
NetU2_32: U2.32(PA7) ; port SRVO_PWM_CLAW_3V3
NetU2_34: U2.34(PC5) ; port SPI3_CSN_WRSTR_3V3
NetU2_43: U2.43(PE12) ; port SPI4_SCK_3V3
NetU2_47: U2.47(PB10) ; port SPI2_SCK_3V3
NetU2_51: U2.51(PB12) ; port CAN2_RX
NetU2_52: U2.52(PB13) ; port CAN2_TX
NetU2_55: U2.55(PD8) ; port SPI1_CSN_TURNTBLE_3V3
NetU2_56: U2.56(PD9) ; port SPI1_CSN_ELBW_3V3
NetU2_70: U2.70(PA11) ; port CAN1_RX
NetU2_71: U2.71(PA12) ; port CAN1_TX
NetU2_78: U2.78(PC10) ; port SPI3_SCK_3V3
NetU2_81: U2.81(PD0) ; port SPI3_CSN_WRSTL_3V3
NetU2_83: U2.83(PD2) ; port SPI3_CSN_SHLDR_3V3
NetU2_89: U2.89(PB3(JTDO/TRACESWO)) ; port SPI1_SCK_3V3

Not connected (* = marked no-connect by the designer): J6 6* 7* 8* 9*; U2 5(PE6)* 9(PC15-OSC32_OUT(PC15))* 15(PC0)* 18(PC3)* 25(PA2)* 37(PB2-BOOT1_(PB2))* 39(PE8)* 41(PE10)* 46(PE15)* 53(PB14)* 57(PD10)* 63(PC6)* 65(PC8)* 68(PA9)* 69(PA10)* 77(PA15(JTDI))* 80(PC12)* 84(PD3)* 88(PD7)* 91(PB5)* 93(PB7)*; Y1 4(NC)*

### Notes on the sheet
- Status LED
- Current Calculations
  RGB LED voltage drops:
  - Red: 2.1V: I = (3.3-2.1V)/120 = 10mA
  - Blue: 3.1V: I = (3.3-3.1V)/120 = 1.67mA
  - Green: 3.1V: I = (3.3-3.1V)/120 = 1.67mA
- 6xVDD pin caps
- Bypass Capacitors
- (near U2) STM32F446VET7
- VDDA pin caps
- VREF+ pin caps
- Programming Header
- Title:
- Project:
- Date:
- Rev:
- Reviewer:
- Engineer:
- Sheet:
- of

### Library data of the parts
C3-C10 = CAP_0.1uF_50V_0603: as C19 on sheet SH4 - LEVEL SHIFTERS; Supplier Part Number 1: 311-1344-1-ND; Supplier 1: Digi-Key; Mounting Type: SMD
C11 = CAP_1uF_25V_0603: CAP CER 1UF 25V X5R 0603; Manufacturer 1: Samsung; Manufacturer Part Number 1: CL10A105KA8NNNC; Package/Footprint: 0603; Supplier Part Number 1: 1276-1102-1-ND; Supplier 1: Digi-Key; Mounting Type: SMD
C12 C13 = CAP_14pF_50V_0603: CAP CER 14PF 50V C0G/NP0 0603; Manufacturer 1: Samsung; Manufacturer Part Number 1: CL10C140JB8NNNC; Package/Footprint: 0603; Supplier 1: Digi-Key; Voltage Rating: 50V; Supplier Part Number 1: 1276-2187-1-ND; Mounting Type: SMD
C14 = CAP_1uF_25V_0603: CAP CER 1UF 25V X5R 0603; Manufacturer Part Number 1: CL10A105KA8NNNC; Manufacturer 1: Samsung; Package/Footprint: 0603; Supplier Part Number 1: 1276-1102-1-ND; Supplier 1: Digi-Key; Mounting Type: SMD
C15 C16 = CAP_4.7uF_50V_1206: CAP CER 4.7UF 50V X7R 1206; Manufacturer Part Number 1: GRM31CR71H475KA12L; Manufacturer 1: Murata; Package/Footprint: 1206; Supplier Part Number 1: 490-6521-1-ND; Supplier 1: Digi-Key; Mounting Type: SMD
D3 = LED_RGB: LED RGB DIFFUSED 4PLCC SMD; Manufacturer 1: Broadcom; Color: Blue,Green,Red; Lens Color: White; Viewing Angle: 115°; Lens Style: Round; Luminous Intensity: 350mcd; Dominant Wavelength: 470nm; Forward Voltage: 3.1V; Test Current: 20mA; Package/Footprint: 4-PLCC; Supplier 1: Digi-Key; Number of Pins: 4; Lens Transparency: Diffused; Supplier Part Number 1: 516-3280-1-ND; Mounting Type: SMD
J6 = CON_PROGRAMMING: CONN HEADER SMD 10POS 1.27MM; Manufacturer 1: Samtec; Supplier 1: Digi-Key; Pitch: 1.27mm; Supplier Part Number 1: SAM8796-ND; Mounting Type: SMD; Package/Footprint: SMD
R11 R13 = RES_10kΩ_0603_5%: as R2 on sheet SH2 - CONNECTORS_1; Supplier Part Number 1: 311-10KGRCT-ND; Supplier 1: Digi-Key; Mounting Type: SMD
R12 R15 = RES_20Ω_0603_5%: RES 20 OHM 5% 1/10W 0603; Manufacturer 1: Yageo; Manufacturer Part Number 1: RC0603JR-0720RL; Supplier Part Number 1: 311-20GRCT-ND; Supplier 1: Digi-Key; Mounting Type: SMD
R14 = RES_120Ω_0603_5%_HP: RES 120 OHM 5% 1/4W 0603; Manufacturer 1: Rohm; Manufacturer Part Number 1: ESR03EZPJ121; Supplier Part Number 1: RHM120DCT-ND; Supplier 1: Digi-Key; Mounting Type: SMD
S1 = SW_TACTILE: SWITCH TACTILE SPST-NO 0.05A 12V; Manufacturer 1: Omron Electronics Inc-EMC Div; Package/Footprint: SMD; Supplier Part Number 1: SW1020CT-ND; Supplier 1: Digi-Key; Manufacturer Part Number 1: B3U-1000P; Mounting Type: SMD
U2 = STM32F446VET6: IC MCU 32BIT 512KB FLASH 100LQFP; Manufacturer 1: STMicroelectronics; Manufacturer Part Number 1: STM32F446VET6TR; Power Supplies: 1.8/3.3V; Speed: 180RPM; Max Supply Current: 115mA; Qualification Status: Not Qualified; Package/Footprint: 100-LQFP; Supplier 1: Digi-Key; Package Code: QFP; Number of Pins: 100; Surface Mount: Yes; Terminal Pitch: 0.5mm; Supplier Part Number 1: 497-19359-1-ND; Mounting Type: SMD
Y1 = CRYSTAL_25MHZ: CRYSTAL 25.0000MHZ 12PF SMD; Manufacturer 1: Kyocera AVX; Supplier 1: Digi-Key; Supplier Part Number 1: 1253-1724-1-ND; Load Capacitance: 12pF; Mounting Type: SMD; Package/Footprint: SMD

## Sheet SH6 - CAN.SchDoc: CAN Transcievers
size B; CheckedBy: Lance Bantoto; DrawnBy: Kyle Hong; Engineer: Kyle Hong; Organization: UW Robotics; Address1: 200 University Avenue; Address2: Waterloo; Address3: Ontario; Address4: Canada N2L 3G6; Revision: 2; SheetNumber: 7; SheetTotal: 8
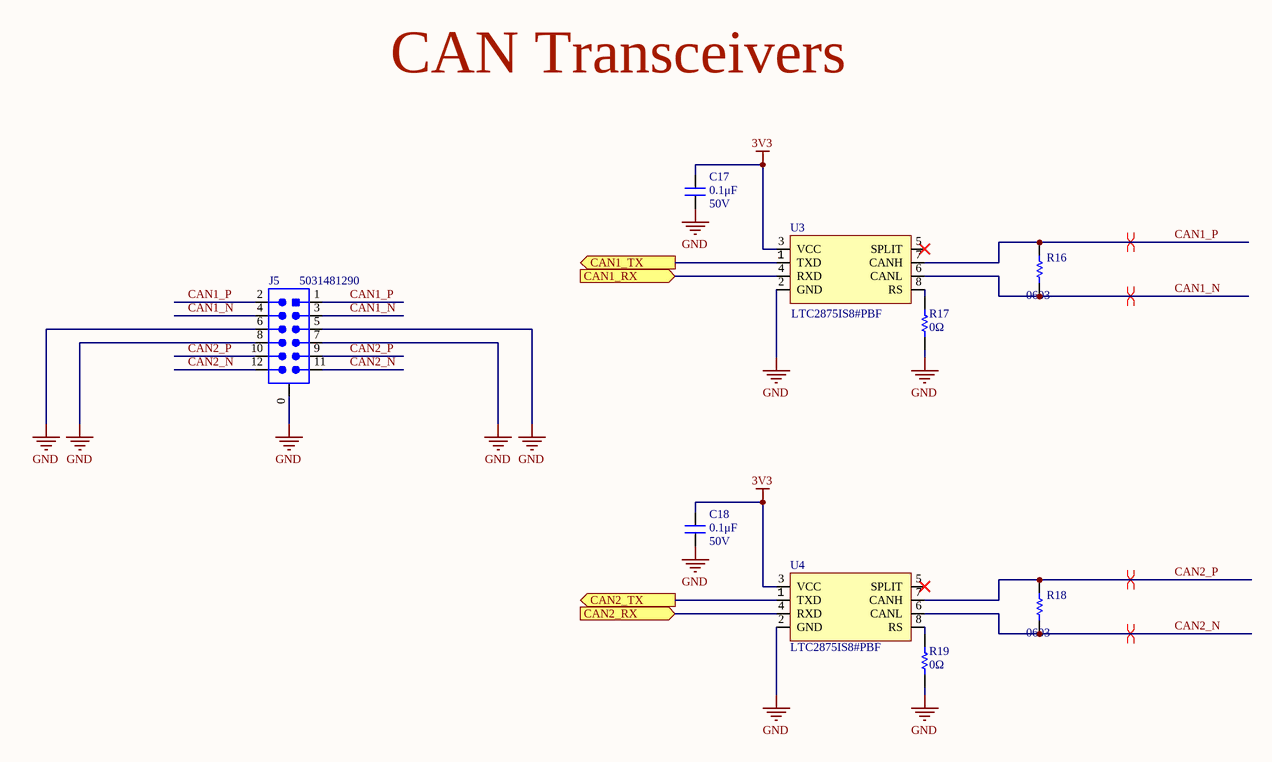
[diagram p4: SH6 - CAN.SchDoc]

### Parts
C17  value 0.1μF  Voltage Rating: 50V  [CAP0603]  (hidden comment: CAP_0.1uF_50V_0603)
C18  value 0.1μF  Voltage Rating: 50V  [CAP0603]  (hidden comment: CAP_0.1uF_50V_0603)
J5  Manufacturer Part Number 1: 5031481290  [MOLEX-5031481290]  (hidden comment: CON_6x2M_SM_RA)
R16  Package/Footprint: 0603  [RESC0603]  (hidden comment: RES_120Ω_0603_5%_HP)
R17  value 0Ω  [RESC0603]  (hidden comment: RES_0Ω_0603)
R18  Package/Footprint: 0603  [RESC0603]  (hidden comment: RES_120Ω_0603_5%_HP)
R19  value 0Ω  [RESC0603]  (hidden comment: RES_0Ω_0603)
U3  Manufacturer Part Number 1: LTC2875IS8#PBF  [LT-S8_N]  (hidden comment: LTC2875)
U4  Manufacturer Part Number 1: LTC2875IS8#PBF  [LT-S8_N]  (hidden comment: LTC2875)

### Ports
CAN1_RX (in), CAN1_TX (out), CAN2_RX (in), CAN2_TX (out)

### Nets
3V3: C17.1 C18.1 U3.3(VCC) U4.3(VCC)
GND: C17.2 C18.2 J5.0 J5.5 J5.6 J5.7 J5.8 R17.1 R19.1 U3.2(GND) U4.2(GND)
CAN1_N: J5.3 J5.4 R16.1 U3.6(CANL)
CAN1_P: J5.1 J5.2 R16.2 U3.7(CANH)
CAN2_N: J5.11 J5.12 R18.1 U4.6(CANL)
CAN2_P: J5.9 J5.10 R18.2 U4.7(CANH)
NetR17_2: R17.2 U3.8(RS)
NetR19_2: R19.2 U4.8(RS)
NetU2_51: U4.4(RXD) ; port CAN2_RX
NetU2_52: U4.1(TXD) ; port CAN2_TX
NetU2_70: U3.4(RXD) ; port CAN1_RX
NetU2_71: U3.1(TXD) ; port CAN1_TX

Not connected (* = marked no-connect by the designer): U3 5(SPLIT)*; U4 5(SPLIT)*

### Layout directives
differential pair: CAN1_N, CAN1_P, CAN2_N, CAN2_P

### Notes on the sheet
- CAN Transceivers
- Title:
- Project:
- Date:
- Rev:
- Reviewer:
- Engineer:
- Sheet:
- of

### Library data of the parts
C17 C18 = CAP_0.1uF_50V_0603: as C19 on sheet SH4 - LEVEL SHIFTERS; Supplier Part Number 1: 311-1344-1-ND; Supplier 1: Digi-Key; Dielectric: X7R; Mounting Type: SMD
J5 = CON_6x2M_SM_RA: as J10 on sheet SH3 - CONNECTORS_2; Supplier 1: Digi-Key; Orientation: Right Angle; Pitch: 1.5mm; Supplier Part Number 1: WM14476CT-ND; Mounting Type: SMD; Package/Footprint: SMD
R16 R18 = RES_120Ω_0603_5%_HP: as R14 on sheet SH5 - MICROCONTROLLER; Supplier Part Number 1: RHM120DCT-ND; Supplier 1: Digi-Key; Mounting Type: SMD
R17 R19 = RES_0Ω_0603: RES 0 OHM JUMPER 1/10W 0603; Manufacturer 1: Yageo; Manufacturer Part Number 1: RC0603JR-070RL; Package/Footprint: 0603; Supplier Part Number 1: 311-0.0GRCT-ND; Supplier 1: Digi-Key; Mounting Type: SMD
U3 U4 = LTC2875: IC TXRX CAN 4MBPS 8SO; Manufacturer 1: Linear Technologies; Package/Footprint: 8-SOIC; Supplier Part Number 1: LTC2875IS8#PBF-ND; Supplier 1: Digi-Key; Mounting Type: SMD; LCSC Part #: C117076

## Nets that join several sheets
3V3: SH2 - CONNECTORS_1 (6 pins), SH3 - CONNECTORS_2 (R20.2 R21.2 R22.2 R25.2), SH5 - MICROCONTROLLER (21 pins), SH6 - CAN (C17.1 C18.1 U3.3 U4.3)
5V_FUSED: SH2 - CONNECTORS_1 (F2.2 F3.2 F4.2), SH3 - CONNECTORS_2 (F5.2 F6.2 F7.2 F8.2), SH4 - LEVEL SHIFTERS (20 pins)
GND: SH2 - CONNECTORS_1 (30 pins), SH3 - CONNECTORS_2 (37 pins), SH4 - LEVEL SHIFTERS (20 pins), SH5 - MICROCONTROLLER (25 pins), SH6 - CAN (11 pins)
NetJ2_6: SH2 - CONNECTORS_1 (J2.6 J3.6 J4.6), SH3 - CONNECTORS_2 (J7.6 J8.11 J9.6), SH4 - LEVEL SHIFTERS (R28.2)
NetJ2_7: SH2 - CONNECTORS_1 (J2.7), SH5 - MICROCONTROLLER (U2.92)
NetJ2_8: SH2 - CONNECTORS_1 (J2.8 J3.8 J4.8), SH3 - CONNECTORS_2 (J7.8 J8.12 J9.8), SH5 - MICROCONTROLLER (U2.4)
NetJ2_10: SH2 - CONNECTORS_1 (J2.10), SH4 - LEVEL SHIFTERS (R29.2)
NetJ2_12: SH2 - CONNECTORS_1 (J2.12), SH5 - MICROCONTROLLER (U2.31)
NetJ2_15: SH2 - CONNECTORS_1 (J2.15 R2.1), SH5 - MICROCONTROLLER (U2.67)
NetJ2_16: SH2 - CONNECTORS_1 (J2.16 R3.1), SH5 - MICROCONTROLLER (U2.66)
NetJ2_17: SH2 - CONNECTORS_1 (J2.17 R4.2), SH5 - MICROCONTROLLER (U2.62)
NetJ2_18: SH2 - CONNECTORS_1 (J2.18), SH5 - MICROCONTROLLER (U2.58)
NetJ2_24: SH2 - CONNECTORS_1 (J2.24), SH4 - LEVEL SHIFTERS (R45.2)
NetJ3_7: SH2 - CONNECTORS_1 (J3.7), SH5 - MICROCONTROLLER (U2.82)
NetJ3_10: SH2 - CONNECTORS_1 (J3.10), SH3 - CONNECTORS_2 (J7.10 J9.10), SH4 - LEVEL SHIFTERS (R27.2)
NetJ3_12: SH2 - CONNECTORS_1 (J3.12), SH3 - CONNECTORS_2 (J7.12 J9.12), SH5 - MICROCONTROLLER (U2.79)
NetJ3_15: SH2 - CONNECTORS_1 (J3.15 R6.1), SH5 - MICROCONTROLLER (U2.35)
NetJ3_16: SH2 - CONNECTORS_1 (J3.16 R5.1), SH5 - MICROCONTROLLER (U2.36)
NetJ3_17: SH2 - CONNECTORS_1 (J3.17 R9.2), SH5 - MICROCONTROLLER (U2.61)
NetJ3_18: SH2 - CONNECTORS_1 (J3.18), SH5 - MICROCONTROLLER (U2.38)
NetJ3_24: SH2 - CONNECTORS_1 (J3.24), SH4 - LEVEL SHIFTERS (R30.2)
NetJ4_7: SH2 - CONNECTORS_1 (J4.7), SH5 - MICROCONTROLLER (U2.33)
NetJ4_10: SH2 - CONNECTORS_1 (J4.10), SH4 - LEVEL SHIFTERS (R31.2)
NetJ4_12: SH2 - CONNECTORS_1 (J4.12), SH5 - MICROCONTROLLER (U2.17)
NetJ4_15: SH2 - CONNECTORS_1 (J4.15 R8.1), SH5 - MICROCONTROLLER (U2.30)
NetJ4_16: SH2 - CONNECTORS_1 (J4.16 R7.1), SH5 - MICROCONTROLLER (U2.29)
NetJ4_17: SH2 - CONNECTORS_1 (J4.17 R10.2), SH5 - MICROCONTROLLER (U2.95)
NetJ4_18: SH2 - CONNECTORS_1 (J4.18), SH5 - MICROCONTROLLER (U2.26)
NetJ4_24: SH2 - CONNECTORS_1 (J4.24), SH4 - LEVEL SHIFTERS (R46.2)
NetJ7_7: SH3 - CONNECTORS_2 (J7.7), SH5 - MICROCONTROLLER (U2.7)
NetJ7_15: SH3 - CONNECTORS_2 (J7.15 R22.1), SH5 - MICROCONTROLLER (U2.45)
NetJ7_16: SH3 - CONNECTORS_2 (J7.16 R21.1), SH5 - MICROCONTROLLER (U2.44)
NetJ7_17: SH3 - CONNECTORS_2 (J7.17 R24.2), SH5 - MICROCONTROLLER (U2.60)
NetJ7_18: SH3 - CONNECTORS_2 (J7.18), SH5 - MICROCONTROLLER (U2.54)
NetJ7_24: SH3 - CONNECTORS_2 (J7.24), SH4 - LEVEL SHIFTERS (R33.2)
NetJ8_4: SH3 - CONNECTORS_2 (J8.4), SH5 - MICROCONTROLLER (U2.3)
NetJ8_7: SH3 - CONNECTORS_2 (J8.7), SH5 - MICROCONTROLLER (U2.2)
NetJ8_8: SH3 - CONNECTORS_2 (J8.8 R20.1), SH5 - MICROCONTROLLER (U2.1)
NetJ8_16: SH3 - CONNECTORS_2 (J8.16), SH4 - LEVEL SHIFTERS (R32.2)
NetJ8_20: SH3 - CONNECTORS_2 (J8.20 R23.2), SH5 - MICROCONTROLLER (U2.59)
NetJ9_7: SH3 - CONNECTORS_2 (J9.7), SH5 - MICROCONTROLLER (U2.8)
NetJ9_16: SH3 - CONNECTORS_2 (J9.16 R25.1), SH5 - MICROCONTROLLER (U2.97)
NetJ9_17: SH3 - CONNECTORS_2 (J9.17 R26.2), SH5 - MICROCONTROLLER (U2.96)
NetJ9_18: SH3 - CONNECTORS_2 (J9.18), SH5 - MICROCONTROLLER (U2.98)
NetJ9_24: SH3 - CONNECTORS_2 (J9.24), SH4 - LEVEL SHIFTERS (R34.2)
NetJ10_1: SH3 - CONNECTORS_2 (J10.1), SH5 - MICROCONTROLLER (U2.24)
NetJ10_2: SH3 - CONNECTORS_2 (J10.2), SH5 - MICROCONTROLLER (U2.23)
NetJ10_3: SH3 - CONNECTORS_2 (J10.3), SH5 - MICROCONTROLLER (U2.42)
NetJ10_4: SH3 - CONNECTORS_2 (J10.4), SH5 - MICROCONTROLLER (U2.40)
NetJ10_5: SH3 - CONNECTORS_2 (J10.5), SH5 - MICROCONTROLLER (U2.64)
NetJ10_6: SH3 - CONNECTORS_2 (J10.6), SH5 - MICROCONTROLLER (U2.90)
NetU2_32: SH4 - LEVEL SHIFTERS (U10.2), SH5 - MICROCONTROLLER (U2.32)
NetU2_34: SH4 - LEVEL SHIFTERS (U12.2), SH5 - MICROCONTROLLER (U2.34)
NetU2_43: SH4 - LEVEL SHIFTERS (U6.2), SH5 - MICROCONTROLLER (U2.43)
NetU2_47: SH4 - LEVEL SHIFTERS (U9.2), SH5 - MICROCONTROLLER (U2.47)
NetU2_51: SH5 - MICROCONTROLLER (U2.51), SH6 - CAN (U4.4)
NetU2_52: SH5 - MICROCONTROLLER (U2.52), SH6 - CAN (U4.1)
NetU2_55: SH4 - LEVEL SHIFTERS (U14.2), SH5 - MICROCONTROLLER (U2.55)
NetU2_56: SH4 - LEVEL SHIFTERS (U13.2), SH5 - MICROCONTROLLER (U2.56)
NetU2_70: SH5 - MICROCONTROLLER (U2.70), SH6 - CAN (U3.4)
NetU2_71: SH5 - MICROCONTROLLER (U2.71), SH6 - CAN (U3.1)
NetU2_78: SH4 - LEVEL SHIFTERS (U5.2), SH5 - MICROCONTROLLER (U2.78)
NetU2_81: SH4 - LEVEL SHIFTERS (U11.2), SH5 - MICROCONTROLLER (U2.81)
NetU2_83: SH4 - LEVEL SHIFTERS (U8.2), SH5 - MICROCONTROLLER (U2.83)
NetU2_89: SH4 - LEVEL SHIFTERS (U7.2), SH5 - MICROCONTROLLER (U2.89)